# Altium schematic sheet A-Main.SchDoc: Main
size A3; SheetNumber: 01; SheetTotal: 03
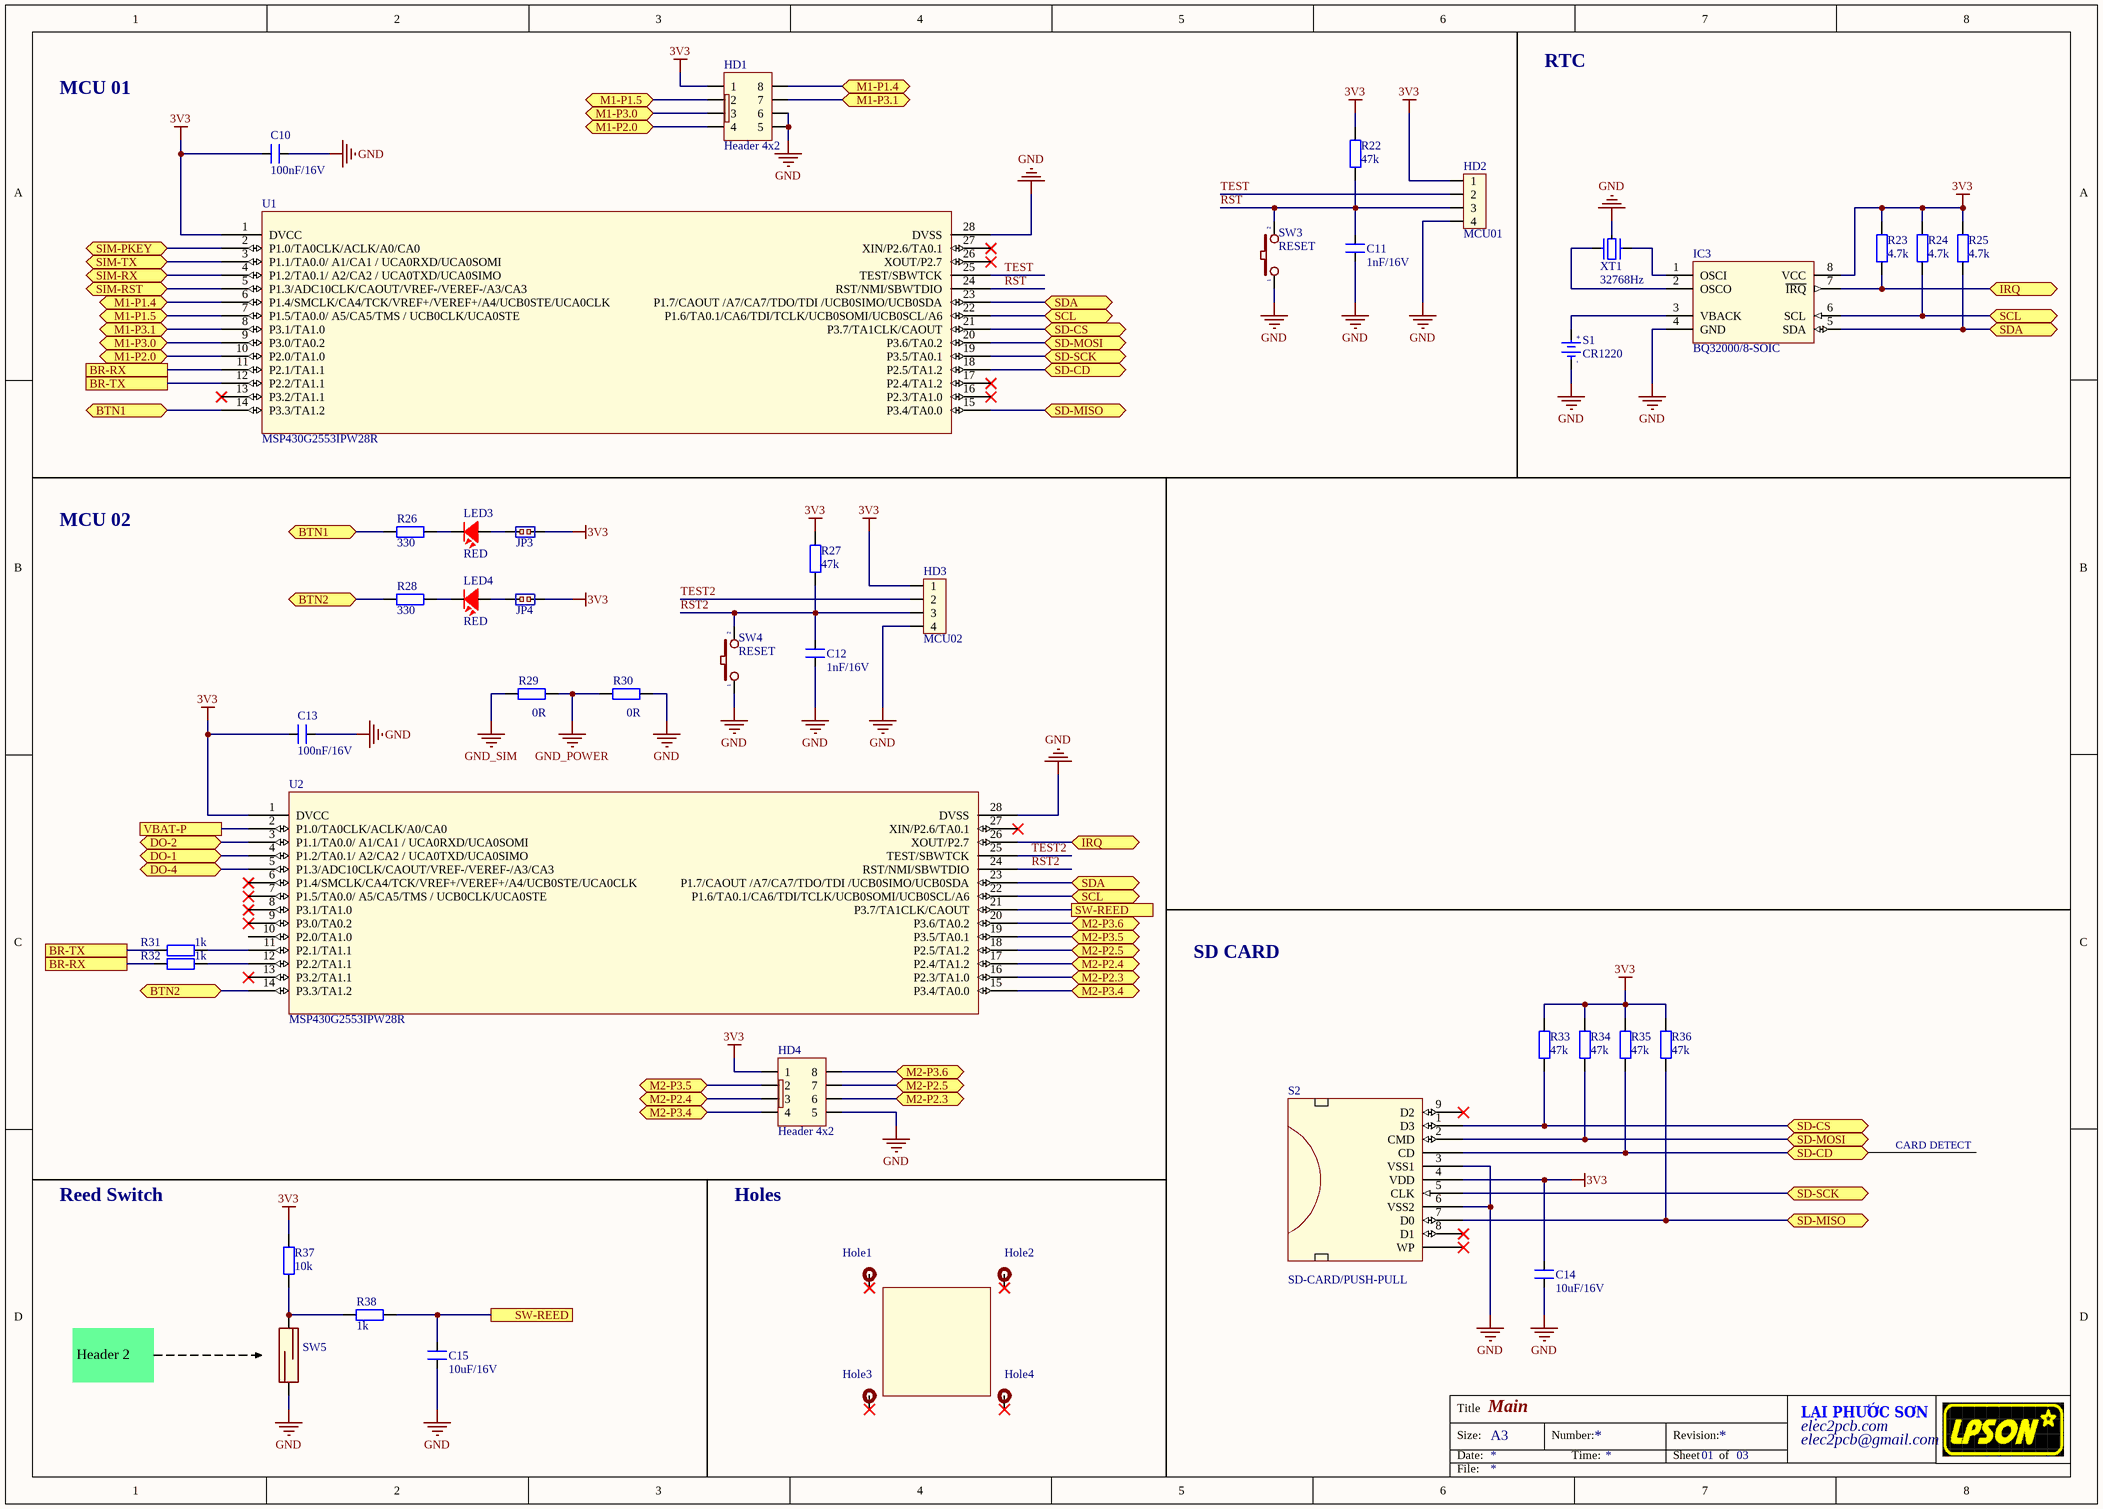
[diagram p0: A-Main.SchDoc]

## Parts
C10  100nF/16V  [C0805-2012]
C11  1nF/16V  [C0603-1608]
C12  1nF/16V  [C0603-1608]
C13  100nF/16V  [C0805-2012]
C14  10uF/16V  [C0805-2012]
C15  10uF/16V  [C0805-2012]
HD1  Header 4x2  [HeaderSP_4x2]
HD2  MCU01  [Header_4]
HD3  MCU02  [Header_4]
HD4  Header 4x2  [HeaderSP_4x2]
Hole1  Pad Big  [Screw 3.0]  (value not drawn)
Hole2  Pad Big  [Screw 3.0]  (value not drawn)
Hole3  Pad Big  [Screw 3.0]  (value not drawn)
Hole4  Pad Big  [Screw 3.0]  (value not drawn)
IC3  BQ32000/8-SOIC  [RTC-BQ32000]
JP3  JP2-ShortingJumper  [Header_2]  (value not drawn)
JP4  JP2-ShortingJumper  [Header_2]  (value not drawn)
LED3  RED  [Led 0805R]
LED4  RED  [Led 0805R]
R22  Resistance (Ohms): 47k  [RESC2012(0805)]
R23  Resistance (Ohms): 4.7k  [RESC2012(0805)]
R24  Resistance (Ohms): 4.7k  [RESC2012(0805)]
R25  Resistance (Ohms): 4.7k  [RESC2012(0805)]
R26  Resistance (Ohms): 330  [RESC2012(0805)]
R27  Resistance (Ohms): 47k  [RESC2012(0805)]
R28  Resistance (Ohms): 330  [RESC2012(0805)]
R29  0R  [RESC2012(0805)]
R30  0R  [RESC2012(0805)]
R31  Resistance (Ohms): 1k  [RESC2012(0805)]
R32  Resistance (Ohms): 1k  [RESC2012(0805)]
R33  Resistance (Ohms): 47k  [RESC2012(0805)]
R34  Resistance (Ohms): 47k  [RESC2012(0805)]
R35  Resistance (Ohms): 47k  [RESC2012(0805)]
R36  Resistance (Ohms): 47k  [RESC2012(0805)]
R37  Resistance (Ohms): 10k  [RESC2012(0805)]
R38  Resistance (Ohms): 1k  [RESC2012(0805)]
S1  value CR1220  [Socket-PIN-BC501SM-TR]  (hidden comment: BAT-HOLDER/CR1220/TME)
S2  SD-CARD/PUSH-PULL  [SD-CARD]
SW3  RESET  [BTN-EVQ-11A04M]
SW4  RESET  [BTN-EVQ-11A04M]
SW5  SW-REED/SPST/NO/350mA  [SWITCH-SDSM]  (value not drawn)
U1  MSP430G2553IPW28R  [MSP430G2253IPW28R]
U2  MSP430G2553IPW28R  [MSP430G2253IPW28R]
XT1  32768Hz  [CR_32768]

## Ports
BR-RX, BR-TX, BTN1 (bidir), BTN2 (bidir), DO-1 (bidir), DO-2 (bidir), DO-4 (bidir), IRQ (bidir), M1-P1.4 (bidir), M1-P1.5 (bidir), M1-P2.0 (bidir), M1-P3.0 (bidir), M1-P3.1 (bidir), M2-P2.3 (bidir), M2-P2.4 (bidir), M2-P2.5 (bidir), M2-P3.4 (bidir), M2-P3.5 (bidir), M2-P3.6 (bidir), SCL (bidir), SD-CD (bidir), SD-CS (bidir), SD-MISO (bidir), SD-MOSI (bidir), SD-SCK (bidir), SDA (bidir), SIM-PKEY (bidir), SIM-RST (bidir), SIM-RX (bidir), SIM-TX (bidir), SW-REED, VBAT-P

## Nets
3V3: C10.1 C13.1 C14.1 HD1.1 HD2.1 HD3.1 HD4.1 IC3.8(VCC) JP3.2 JP4.2 R22.2 R23.2 R24.2 R25.2 R27.2 R33.2 R34.2 R35.2 R36.2 R37.1 S2.4(VDD) U1.1(DVCC) U2.1(DVCC)
GND: C10.2 C11.2 C12.2 C13.2 C14.2 C15.2 HD1.5 HD1.6 HD2.4 HD3.4 HD4.5 IC3.4(GND) R30.1 S1.2(GND) S2.3(VSS1) S2.6(VSS2) SW3.1 SW4.1 SW5.1 U1.28(DVSS) U2.28(DVSS) XT1.0(Case)
GND_POWER: R29.1 R30.2
GND_SIM: R29.2
BR-RX: R32.2 U1.11(P2.1/TA1.1) ; port BR-RX
BR-TX: R31.2 U1.12(P2.2/TA1.1) ; port BR-TX
BTN1: R26.2 U1.14(P3.3/TA1.2) ; port BTN1
BTN2: R28.2 U2.14(P3.3/TA1.2) ; port BTN2
DO-1: U2.4(P1.2/TA0.1/_A2/CA2_/_UCA0TXD/UCA0SIMO) ; port DO-1
DO-2: U2.3(P1.1/TA0.0/_A1/CA1_/_UCA0RXD/UCA0SOMI) ; port DO-2
DO-4: U2.5(P1.3/ADC10CLK/CAOUT/VREF-/VEREF-/A3/CA3) ; port DO-4
IRQ: IC3.7(~{IRQ}) R23.1 U2.26(XOUT/P2.7) ; port IRQ
M1-P1.4: HD1.8 U1.6(P1.4/SMCLK/CA4/TCK/VREF+/VEREF+/A4/UCB0STE/UCA0CLK) ; port M1-P1.4
M1-P1.5: HD1.2 U1.7(P1.5/TA0.0/_A5/CA5/TMS_/_UCB0CLK/UCA0STE) ; port M1-P1.5
M1-P2.0: HD1.4 U1.10(P2.0/TA1.0) ; port M1-P2.0
M1-P3.0: HD1.3 U1.9(P3.0/TA0.2) ; port M1-P3.0
M1-P3.1: HD1.7 U1.8(P3.1/TA1.0) ; port M1-P3.1
M2-P2.3: HD4.6 U2.16(P2.3/TA1.0) ; port M2-P2.3
M2-P2.4: HD4.3 U2.17(P2.4/TA1.2) ; port M2-P2.4
M2-P2.5: HD4.7 U2.18(P2.5/TA1.2) ; port M2-P2.5
M2-P3.4: HD4.4 U2.15(P3.4/TA0.0) ; port M2-P3.4
M2-P3.5: HD4.2 U2.19(P3.5/TA0.1) ; port M2-P3.5
M2-P3.6: HD4.8 U2.20(P3.6/TA0.2) ; port M2-P3.6
RST: C11.1 HD2.3 R22.1 SW3.2 U1.24(RST/NMI/SBWTDIO)
RST2: C12.1 HD3.3 R27.1 SW4.2 U2.24(RST/NMI/SBWTDIO)
SCL: IC3.6(SCL) R24.1 U1.22(P1.6/TA0.1/CA6/TDI/TCLK/UCB0SOMI/UCB0SCL/A6) U2.22(P1.6/TA0.1/CA6/TDI/TCLK/UCB0SOMI/UCB0SCL/A6) ; port SCL
SD-CD: R35.1 S2.CD U1.18(P2.5/TA1.2) ; port SD-CD
SD-CS: R33.1 S2.1(D3) U1.21(P3.7/TA1CLK/CAOUT) ; port SD-CS
SD-MISO: R36.1 S2.7(D0) U1.15(P3.4/TA0.0) ; port SD-MISO
SD-MOSI: R34.1 S2.2(CMD) U1.20(P3.6/TA0.2) ; port SD-MOSI
SD-SCK: S2.5(CLK) U1.19(P3.5/TA0.1) ; port SD-SCK
SDA: IC3.5(SDA) R25.1 U1.23(P1.7/CAOUT_/A7/CA7/TDO/TDI_/UCB0SIMO/UCB0SDA) U2.23(P1.7/CAOUT_/A7/CA7/TDO/TDI_/UCB0SIMO/UCB0SDA) ; port SDA
SIM-PKEY: U1.2(P1.0/TA0CLK/ACLK/A0/CA0) ; port SIM-PKEY
SIM-RST: U1.5(P1.3/ADC10CLK/CAOUT/VREF-/VEREF-/A3/CA3) ; port SIM-RST
SIM-RX: U1.4(P1.2/TA0.1/_A2/CA2_/_UCA0TXD/UCA0SIMO) ; port SIM-RX
SIM-TX: U1.3(P1.1/TA0.0/_A1/CA1_/_UCA0RXD/UCA0SOMI) ; port SIM-TX
SW-REED: C15.1 R38.1 U2.21(P3.7/TA1CLK/CAOUT) ; port SW-REED
TEST: HD2.2 U1.25(TEST/SBWTCK)
TEST2: HD3.2 U2.25(TEST/SBWTCK)
VBAT-P: U2.2(P1.0/TA0CLK/ACLK/A0/CA0) ; port VBAT-P
NetIC3_1: IC3.1(OSCI) XT1.2
NetIC3_2: IC3.2(OSCO) XT1.1
NetIC3_3: IC3.3(VBACK) S1.1(+3V)
NetJP3_1: JP3.1 LED3.1(A)
NetJP4_1: JP4.1 LED4.1(A)
NetLED3_2: LED3.2(K) R26.1
NetLED4_2: LED4.2(K) R28.1
NetR31_1: R31.1 U2.11(P2.1/TA1.1)
NetR32_1: R32.1 U2.12(P2.2/TA1.1)
NetR37_2: R37.2 R38.2 SW5.2

Not connected (* = marked no-connect by the designer): Hole1 1*; Hole2 1*; Hole3 1*; Hole4 1*; S2 8(D1)* 9(D2)* WP*; U1 13(P3.2/TA1.1)* 16(P2.3/TA1.0)* 17(P2.4/TA1.2)* 26(XOUT/P2.7)* 27(XIN/P2.6/TA0.1)*; U2 6(P1.4/SMCLK/CA4/TCK/VREF+/VEREF+/A4/UCB0STE/UCA0CLK)* 7(P1.5/TA0.0/_A5/CA5/TMS_/_UCB0CLK/UCA0STE)* 8(P3.1/TA1.0)* 9(P3.0/TA0.2)* 10(P2.0/TA1.0) 13(P3.2/TA1.1)* 27(XIN/P2.6/TA0.1)*

## Notes on the sheet
- MCU 01
- RTC
- MCU 02
- SD CARD
- CARD DETECT
- Reed Switch
- Holes
- Header 2
- Title
- Size:
- Date:
- A3
- Number:
- Time:
- Revision:
- Sheet
- of
- LẠI PHƯỚC SƠN
- elec2pcb@gmail.com
- elec2pcb.com
- File:
- (in symbol BAT-HOLDER/CR1220/TME) +; -

## Library data of the parts
C10 C13 = CAP-CER/100nF/16V/X7R/0805: CAP CER 0.1UF 16V X7R 0805; Manufacturer: Kemet; Manufacturer Part Number: C0805C104K4RACTU; Capacitance: 0.10µF; Tolerance: ±10%; Supplier 1: Digi-Key; RoHS: RoHS Compliant; Category: Capacitors; Stock 1: 366123; Pricing 1: 1=0.11, 10=0.075, 50=0.0432, 100=0.0356, 250=0.03, 500=0.02512, 1000=0.02063 (USD); Packaging: Cut Tape (CT); Voltage - Rated: 16V; Temperature Coefficient: X7R; Mounting Type: Surface Mount, MLCC; Operating Temperature: -55°C ~ 125°C; Applications: General Purpose; Ratings: -; Package / Case: 0805 (2012 Metric); Size / Dimension: 0.079" L x 0.049" W (2.00mm x 1.25mm); Height - Seated (Max): -; Thickness (Max): 0.035" (0.88mm); Lead Spacing: -; Features: Low ESL; Lead Style: -; ComponentLink1URL: http://www.kemet.com/docfinder?Partnumber=C0805C104K4RACTU; ComponentLink1Description: http://www.kemet.com/docfinder?Partnumber=C0805C104K4RACTU; Supplier Part Number 1: 399-1167-1-ND
C11 C12 = CAP-CER/1nF/16V/X7R/0603: CAP CER 1000PF 16V X7R 0603; Manufacturer: AVX Corporation; Manufacturer Part Number: 0603YC102KAT2A; Tolerance: ±10%; Supplier 1: Digi-Key; Supplier Part Number 1: 478-7933-1-ND; Stock: 28476; Pricing: 1=0.23, 10=0.157, 100=0.0798, 250=0.0646, 500=0.057, 1000=0.04845 (USD); Packaging: Cut Tape (CT); Capacitance: 1000pF; Voltage - Rated: 16V; Temperature Coefficient: X7R; Mounting Type: Surface Mount, MLCC; Operating Temperature: -55°C ~ 125°C; Applications: General Purpose; Ratings: -; Package / Case: 0603 (1608 Metric); Size / Dimension: 0.063" L x 0.032" W (1.60mm x 0.81mm); Height - Seated (Max): -; Thickness (Max): 0.035" (0.90mm); Lead Spacing: -; Features: -; Lead Style: -; ComponentLink1URL: http://www.avx.com/docs/Catalogs/cx7r.pdf; ComponentLink1Description: http://www.avx.com/docs/Catalogs/cx7r.pdf
C14 C15 = CAP-CER/10UF/16V/X5R/0805: CAP CER 10UF 16V X5R 0805; Manufacturer: Murata Electronics North America; Manufacturer Part Number: GRM21BR61C106KE15L; Capacitance: 10µF; Tolerance: ±10%; Supplier 1: Digi-Key; Supplier Part Number 1: 490-3886-1-ND; Stock: 1364697; Pricing: 1=0.2, 10=0.136, 50=0.0826, 100=0.0693, 250=0.05612, 500=0.0495, 1000=0.04208 (USD); Packaging: Cut Tape (CT); Voltage - Rated: 16V; Temperature Coefficient: X5R; Mounting Type: Surface Mount, MLCC; Operating Temperature: -55°C ~ 85°C; Applications: General Purpose; Ratings: -; Package / Case: 0805 (2012 Metric); Size / Dimension: 0.079" L x 0.049" W (2.00mm x 1.25mm); Height - Seated (Max): -; Thickness (Max): 0.053" (1.35mm); Lead Spacing: -; Features: -; Lead Style: -; ComponentLink1URL: http://www.murata.com/~/media/webrenewal/support/library/catalog/products/capacitor/mlcc/c02e.ashx; ComponentLink1Description: http://www.murata.com/~/media/webrenewal/support/library/catalog/products/capacitor/mlcc/c02e.ashx
HD1 HD4 = HED-4X2/MALE/2.54MM-B: HEADER, 4X2, 2.54MM, MALE; Value: Header 4x2; Supplier Link: http://tme.vn/Product.aspx?id=516#page=pro_info
HD2 HD3 = Hed4: Header 4; Value: Header 4; Supplier Link: http://tme.vn/Product.aspx?id=518#page=pro_info
Hole1-Hole4 = Pad_Big: Value: Pad Big - Hole
IC3 = BQ32000/8-SOIC: IC RTC CLK/CALENDAR I2C 8-SOIC; Manufacturer: Texas Instruments; Manufacturer Part Number: BQ32000DR; Time Format: HH:MM:SS (24 hr); Date Format: YY-MM-DD-dd; Interface: I²C, 2-Wire Serial; Voltage - Supply: 3 V ~ 3.6 V; Voltage - Supply, Battery: 1.4 V ~ 3.6 V; Current - Timekeeping (Max): 100µA @ 3.3V; Supplier 1: Digi-Key; RoHS: RoHS Compliant; Category: Integrated Circuits (ICs); Stock 1: 4145; Pricing 1: 1=2.05, 10=1.843, 100=1.4783, 500=1.215, 1000=0.84375 (USD); Packaging: Cut Tape (CT); Type: Clock/Calendar; Features: Leap Year, Square Wave Output, Trickle-Charger; Memory Size: -; Operating Temperature: -40°C ~ 85°C; Mounting Type: Surface Mount; Package / Case: 8-SOIC (0.154", 3.90mm Width); Supplier Device Package: 8-SOIC; ComponentLink1URL: http://www.ti.com/lit/ds/symlink/bq32000.pdf; ComponentLink1Description: http://www.ti.com/lit/ds/symlink/bq32000.pdf; Supplier Part Number 1: 296-24583-1-ND
JP3 JP4 = JP2-ShortingJumper: 2.54mm 2-Pin Shorting Jumper; Value: Shorting Jumper; Supplier Link: http://tme.vn/Product.aspx?id=509#page=pro_info
LED3 LED4 = LED-RED/CLEAR/0805: LED RED CLEAR 0805 SMD; Manufacturer: Lite-On Inc.; Manufacturer Part Number: LTST-C171KRKT; Wavelength - Dominant: 631nm; Wavelength - Peak: 639nm; Millicandela Rating: 54mcd; Voltage - Forward (Vf) (Typ): 2V; Current - Test: 20mA; Viewing Angle: 130°; Lens Color: Colorless; Lens Style/Size: Rectangle with Flat Top, 1.40mm x 1.25mm; Supplier 1: Digi-Key; Supplier Part Number 1: 160-1427-1-ND; Stock: 74706; Pricing: 1=0.27, 10=0.213, 100=0.1161, 250=0.0774, 500=0.0658, 1000=0.05031 (USD); Packaging: Cut Tape (CT); Color: Red; Lens Transparency: Clear; Package / Case: 0805 (2012 Metric); Supplier Device Package: *; Size / Dimension: 2.00mm L x 1.25mm W; Height (Max): 0.80mm; Mounting Type: Surface Mount; ComponentLink1URL: http://optoelectronics.liteon.com/upload/download/DS22-2000-109/S_110_LTST-C171KRKT.pdf; ComponentLink1Description: http://optoelectronics.liteon.com/upload/download/DS22-2000-109/S_110_LTST-C171KRKT.pdf
R22 R27 R33-R36 = RES-0805/±5%: RES SMD 47K OHM 5% 1/8W 0805; Manufacturer: Yageo; Manufacturer Part Number: RC0805JR-0747KL; Power (Watts): 0.125W, 1/8W; Temperature Coefficient: ±100ppm/°C; Supplier 1: Digi-Key; Supplier Part Number 1: 311-47KARCT-ND; RoHS: RoHS Compliant; Category: Resistors; Stock 1: 595084; Pricing 1: 1=0.1, 10=0.018, 25=0.0128, 100=0.0073, 250=0.00556, 500=0.00444, 1000=0.00326, 2500=0.00283 (USD); Packaging: Cut Tape (CT); Tolerance: ±5%; Composition: Thick Film; Features: Moisture Resistant; Operating Temperature: -55°C ~ 155°C; Package / Case: 0805 (2012 Metric); Supplier Device Package: 0805; Size / Dimension: 0.079" L x 0.049" W (2.00mm x 1.25mm); Height: 0.024" (0.60mm); Number of Terminations: 2; ComponentLink1URL: http://www.yageo.com/documents/recent/PYu-RC_Group_51_RoHS_L_04.pdf; ComponentLink1Description: http://www.yageo.com/documents/recent/PYu-RC_Group_51_RoHS_L_04.pdf
R23-R25 = RES-0805/±5%: RES SMD 4.7K OHM 5% 1/8W 0805; Manufacturer: Yageo; Manufacturer Part Number: RC0805JR-074K7L; Power (Watts): 0.125W, 1/8W; Temperature Coefficient: ±100ppm/°C; Supplier 1: Digi-Key; Supplier Part Number 1: 311-4.7KARCT-ND; RoHS: RoHS Compliant; Category: Resistors; Stock 1: 891032; Pricing 1: 1=0.1, 10=0.018, 25=0.0128, 100=0.0073, 250=0.00556, 500=0.00444, 1000=0.00326, 2500=0.00283 (USD); Packaging: Cut Tape (CT); Tolerance: ±5%; Composition: Thick Film; Features: Moisture Resistant; Operating Temperature: -55°C ~ 155°C; Package / Case: 0805 (2012 Metric); Supplier Device Package: 0805; Size / Dimension: 0.079" L x 0.049" W (2.00mm x 1.25mm); Height: 0.024" (0.60mm); Number of Terminations: 2; ComponentLink1URL: http://www.yageo.com/documents/recent/PYu-RC_Group_51_RoHS_L_04.pdf; ComponentLink1Description: http://www.yageo.com/documents/recent/PYu-RC_Group_51_RoHS_L_04.pdf
R26 R28 = RES-0805/±5%: RES SMD 330 OHM 5% 1/8W 0805; Manufacturer: Yageo; Manufacturer Part Number: RC0805JR-07330RL; Power (Watts): 0.125W, 1/8W; Temperature Coefficient: ±100ppm/°C; Supplier 1: Digi-Key; Supplier Part Number 1: 311-330ARCT-ND; RoHS: RoHS Compliant; Category: Resistors; Stock 1: 538867; Pricing 1: 1=0.1, 10=0.018, 25=0.0128, 100=0.0073, 250=0.00556, 500=0.00444, 1000=0.00326, 2500=0.00283 (USD); Packaging: Cut Tape (CT); Tolerance: ±5%; Composition: Thick Film; Features: Moisture Resistant; Operating Temperature: -55°C ~ 155°C; Package / Case: 0805 (2012 Metric); Supplier Device Package: 0805; Size / Dimension: 0.079" L x 0.049" W (2.00mm x 1.25mm); Height: 0.024" (0.60mm); Number of Terminations: 2; ComponentLink1URL: http://www.yageo.com/documents/recent/PYu-RC_Group_51_RoHS_L_04.pdf; ComponentLink1Description: http://www.yageo.com/documents/recent/PYu-RC_Group_51_RoHS_L_04.pdf
R29 R30 = RES-0805/±5%: RES SMD 330 OHM 5% 1/8W 0805; Manufacturer: Yageo; Manufacturer Part Number: RC0805JR-07330RL; Resistance (Ohms): 330; Power (Watts): 0.125W, 1/8W; Temperature Coefficient: ±100ppm/°C; Supplier 1: Digi-Key; Supplier Part Number 1: 311-330ARCT-ND; RoHS: RoHS Compliant; Category: Resistors; Stock 1: 538867; Pricing 1: 1=0.1, 10=0.018, 25=0.0128, 100=0.0073, 250=0.00556, 500=0.00444, 1000=0.00326, 2500=0.00283 (USD); Packaging: Cut Tape (CT); Tolerance: ±5%; Composition: Thick Film; Features: Moisture Resistant; Operating Temperature: -55°C ~ 155°C; Package / Case: 0805 (2012 Metric); Supplier Device Package: 0805; Size / Dimension: 0.079" L x 0.049" W (2.00mm x 1.25mm); Height: 0.024" (0.60mm); Number of Terminations: 2; ComponentLink1URL: http://www.yageo.com/documents/recent/PYu-RC_Group_51_RoHS_L_04.pdf; ComponentLink1Description: http://www.yageo.com/documents/recent/PYu-RC_Group_51_RoHS_L_04.pdf
R31 R32 R38 = RES-0805/±5%: RES SMD 1K OHM 5% 1/8W 0805; Manufacturer: Yageo; Manufacturer Part Number: RC0805JR-071KL; Power (Watts): 0.125W, 1/8W; Temperature Coefficient: ±100ppm/°C; Supplier 1: Digi-Key; Supplier Part Number 1: 311-1.0KARCT-ND; RoHS: RoHS Compliant; Category: Resistors; Stock 1: 1526483; Pricing 1: 1=0.1, 10=0.018, 25=0.0128, 100=0.0073, 250=0.00556, 500=0.00444, 1000=0.00326, 2500=0.00283 (USD); Packaging: Cut Tape (CT); Tolerance: ±5%; Composition: Thick Film; Features: Moisture Resistant; Operating Temperature: -55°C ~ 155°C; Package / Case: 0805 (2012 Metric); Supplier Device Package: 0805; Size / Dimension: 0.079" L x 0.049" W (2.00mm x 1.25mm); Height: 0.024" (0.60mm); Number of Terminations: 2; ComponentLink1URL: http://www.yageo.com/documents/recent/PYu-RC_Group_51_RoHS_L_04.pdf; ComponentLink1Description: http://www.yageo.com/documents/recent/PYu-RC_Group_51_RoHS_L_04.pdf
R37 = RES-0805/±5%: RES SMD 10K OHM 5% 1/8W 0805; Manufacturer: Yageo; Manufacturer Part Number: RC0805JR-0710KL; Power (Watts): 0.125W, 1/8W; Temperature Coefficient: ±100ppm/°C; Supplier 1: Digi-Key; Supplier Part Number 1: 311-10KARCT-ND; RoHS: RoHS Compliant; Category: Resistors; Stock 1: 1117583; Pricing 1: 1=0.1, 10=0.018, 25=0.0128, 100=0.0073, 250=0.00556, 500=0.00444, 1000=0.00326, 2500=0.00283 (USD); Packaging: Cut Tape (CT); Tolerance: ±5%; Composition: Thick Film; Features: Moisture Resistant; Operating Temperature: -55°C ~ 155°C; Package / Case: 0805 (2012 Metric); Supplier Device Package: 0805; Size / Dimension: 0.079" L x 0.049" W (2.00mm x 1.25mm); Height: 0.024" (0.60mm); Number of Terminations: 2; ComponentLink1URL: http://www.yageo.com/documents/recent/PYu-RC_Group_51_RoHS_L_04.pdf; ComponentLink1Description: http://www.yageo.com/documents/recent/PYu-RC_Group_51_RoHS_L_04.pdf
S1 = BAT-HOLDER/CR1220/TME: CR1220 Battery Holder SMD; Supplier Link: http://tme.vn/Product.aspx?id=1796#page=pro_info; ComponentLink1URL: http://www.memoryprotectiondevices.com/datasheets/BC501SM-TR-datasheet.pdf; ComponentLink1Description: http://www.memoryprotectiondevices.com/datasheets/BC501SM-TR-datasheet.pdf; Supplier 1: TME.VN
S2 = SD-CARD/PUSH-PULL: CONN SD CARD PUSH-PUSH R/A SMD; Manufacturer: Amphenol Commercial Products; Manufacturer Part Number: 101-00313-68-02; Card Type: Secure Digital - SD; Number of Positions: 9; Connector Type: Connector and Ejector; Insertion, Removal Method: Push In, Push Out; Supplier 1: Digi-Key; RoHS: RoHS Compliant; Category: Connectors, Interconnects; Stock 1: 7364; Pricing 1: 1=2.33, 10=2.11, 25=1.9808, 50=1.8948, 100=1.8087 (USD); Packaging: Cut Tape (CT); Ejector Side: -; Mounting Type: Surface Mount, Right Angle; Features: Board Guide; Height Above Board: 0.106" (2.70mm); Mounting Feature: Normal, Standard - Top; Contact Finish: Gold; Contact Finish Thickness: 15µin (0.38µm); ComponentLink1URL: http://media.digikey.com/pdf/Data%20Sheets/Amphenol%20PDFs/101-00313.pdf; ComponentLink1Description: http://media.digikey.com/pdf/Data%20Sheets/Amphenol%20PDFs/101-00313.pdf; Supplier Part Number 1: 101-00313-68-02CT-ND
SW3 SW4 = SW2-PUSH/SPST/NO: SWITCH TACTILE SPST-NO 0.02A 15V; Manufacturer: Panasonic Electronic Components; Manufacturer Part Number: EVQ-11A04M; Switch Function: Off-Mom; Contact Rating @ Voltage: 0.02A @ 15VDC; Actuator Type: Standard; Actuator Height off PCB, from Pins: 4.30mm; Actuator Orientation: Top Actuated; Outline: 6.00mm x 6.00mm; Illumination: Non-Illuminated; Operating Force: 100gf; Switch Travel: 0.25mm; Mechanical Life: 100,000 Cycles; Supplier 1: Digi-Key; RoHS: RoHS Compliant; Category: Switches; Stock 1: 4758; Pricing 1: 1=0.29, 10=0.273, 25=0.2344, 50=0.1992, 100=0.1913, 250=0.17184, 500=0.16402, 1000=0.13668 (USD); Packaging: Cut Tape (CT); Circuit: SPST-NO; Mounting Type: Through Hole; Termination Style: PC Pin; Illumination Voltage (Nominal): -; Illumination Type, Color: -; Ingress Protection: -; Features: -; Actuator Material: -; Operating Temperature: -20°C ~ 70°C; ComponentLink1URL: http://industrial.panasonic.com/cdbs/www-data/pdf/ATK0000/ATK0000CE11.pdf; ComponentLink1Description: http://industrial.panasonic.com/cdbs/www-data/pdf/ATK0000/ATK0000CE11.pdf; Supplier Part Number 1: P8070SCT-ND
SW5 = SW-REED/SPST/NO/350mA: SWITCH REED SPST-NO 350MA 140V; Manufacturer: Littelfuse Inc.; Manufacturer Part Number: MDSM-4R-12-18; Operate Range: 12 ~ 18AT; Current - Switching: 350mA (AC), 500mA (DC); Voltage - Switching DC: 200V; Power - Rated: 10W; Operate Time: 0.6ms; Release Time: 0.2ms; Capacitance: 0.20pF; Current - Carry: 1.2A (DC); Supplier 1: Digi-Key; RoHS: RoHS Compliant; Category: Switches; Stock 1: 153096; Pricing 1: 1=0.74, 10=0.693, 25=0.6236, 100=0.5313, 250=0.48512, 500=0.462, 1000=0.38115 (USD); Packaging: Cut Tape (CT); Type: Glass Body; Circuit: SPST-NO; Release Range: -; Voltage - Switching AC: 140V; Mounting Type: Surface Mount; Termination Style: Gull Wing; Length - Overall: 0.760" (19.30mm); Size - Body: 0.090" Dia x 0.600" L (2.28mm x 15.24mm); Height Above Board: 0.112" (2.85mm); Operating Temperature: -40°C ~ 125°C; ComponentLink1URL: http://www.littelfuse.com/~/media/electronics/datasheets/reed_switches/littelfuse_reed_switches_mdsm_4_datasheet.pdf.pdf; ComponentLink1Description: http://www.littelfuse.com/~/media/electronics/datasheets/reed_switches/littelfuse_reed_switches_mdsm_4_datasheet.pdf.pdf; Supplier Part Number 1: HE151CT-ND
U1 U2 = MSP430G2553IPW28R: IC MCU 16BIT 16KB FLASH 28TSSOP; Manufacturer: Texas Instruments; Core Processor: MSP430; Core Size: 16-Bit; Speed: 16MHz; Connectivity: I²C, IrDA, LIN, SCI, SPI, UART/USART; Peripherals: Brown-out Detect/Reset, DMA, POR, PWM, WDT; Number of I/O: 24; Program Memory Size: 16KB (16K x 8); RAM Size: 512 x 8; Voltage - Supply (Vcc/Vdd): 1.8 V ~ 3.6 V; Data Converters: A/D 8x10b; Oscillator Type: Internal; Supplier 1: Digi-Key; Manufacturer Part Number: MSP430G2553IPW28R; RoHS: RoHS Compliant; Category: Integrated Circuits (ICs); Stock 1: 6523; Pricing 1: 1=2.6, 10=2.334, 100=1.8725, 500=1.539, 1000=1.06875 (USD); Packaging: Cut Tape (CT); Program Memory Type: FLASH; EEPROM Size: -; Operating Temperature: -40°C ~ 85°C (TA); Package / Case: 28-TSSOP (0.173", 4.40mm Width); Supplier Device Package: 28-TSSOP; ComponentLink1URL: http://www.ti.com/lit/ds/symlink/msp430g2553.pdf; ComponentLink1Description: http://www.ti.com/lit/ds/symlink/msp430g2553.pdf; Supplier Part Number 1: 296-28431-1-ND
XT1 = XT-32768HZ/RADIAL: CRYSTAL 32.7680KHZ 12.5PF T/H; Manufacturer: Citizen Finedevice Co Ltd; Manufacturer Part Number: CFS206-32.768KDZF-UB; Frequency: 32.768kHz; Frequency Tolerance: ±20ppm; ESR (Equivalent Series Resistance): 35 kOhm; Operating Mode: Fundamental; Supplier 1: Digi-Key; RoHS: RoHS Compliant; Category: Crystals and Oscillators; Stock 1: 53709; Pricing 1: 1=0.24, 10=0.2, 50=0.18, 100=0.16, 500=0.152, 1000=0.128, 2500=0.12, 5000=0.116 (USD); Packaging: Bulk; Type: kHz Crystal (Tuning Fork); Frequency Stability: -; Load Capacitance: 12.5pF; Operating Temperature: -20°C ~ 70°C; Ratings: -; Mounting Type: Through Hole; Package / Case: Cylindrical Can, Radial; Size / Dimension: 0.075" Dia (1.90mm); Height: 0.244" (6.20mm); ComponentLink1URL: http://cfd.citizen.co.jp/english/prod-tech/product/pdf/datasheet_TF/CFS-145%20CFS-206%20CFV-206_E.pdf; ComponentLink1Description: http://cfd.citizen.co.jp/english/prod-tech/product/pdf/datasheet_TF/CFS-145%20CFS-206%20CFV-206_E.pdf; Supplier Part Number 1: 300-1002-ND